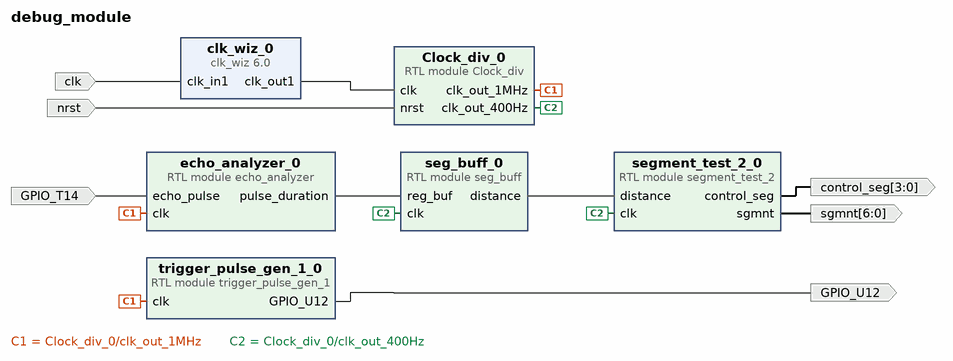
[diagram p0: block diagram of the top level]
# Vivado block design debug_module, xc7z020clg400-1, Vivado 2023.1
create_bd_design debug_module

create_bd_port -dir O GPIO_U12
create_bd_port -dir I GPIO_T14
create_bd_port -dir O -from 6 -to 0 sgmnt
create_bd_port -dir O -from 3 -to 0 control_seg
create_bd_port -dir I clk
create_bd_port -dir I nrst

create_bd_cell -type module -reference Clock_div Clock_div_0
create_bd_cell -type module -reference segment_test_2 segment_test_2_0
create_bd_cell -type module -reference trigger_pulse_gen_1 trigger_pulse_gen_1_0
create_bd_cell -type ip -vlnv xilinx.com:ip:clk_wiz:6.0 clk_wiz_0
set_property -dict [list \
  CONFIG.CLKIN1_JITTER_PS 80.0 \
  CONFIG.CLKOUT1_DRIVES BUFG \
  CONFIG.CLKOUT1_JITTER 288.707 \
  CONFIG.CLKOUT1_PHASE_ERROR 258.220 \
  CONFIG.CLKOUT1_REQUESTED_OUT_FREQ 50 \
  CONFIG.CLKOUT2_DRIVES BUFG \
  CONFIG.CLKOUT3_DRIVES BUFG \
  CONFIG.CLKOUT4_DRIVES BUFG \
  CONFIG.CLKOUT5_DRIVES BUFG \
  CONFIG.CLKOUT6_DRIVES BUFG \
  CONFIG.CLKOUT7_DRIVES BUFG \
  CONFIG.CLK_IN1_BOARD_INTERFACE sys_clock \
  CONFIG.MMCM_BANDWIDTH OPTIMIZED \
  CONFIG.MMCM_CLKFBOUT_MULT_F 34 \
  CONFIG.MMCM_CLKIN1_PERIOD 8.000 \
  CONFIG.MMCM_CLKIN2_PERIOD 10.0 \
  CONFIG.MMCM_CLKOUT0_DIVIDE_F 17 \
  CONFIG.MMCM_COMPENSATION ZHOLD \
  CONFIG.MMCM_DIVCLK_DIVIDE 5 \
  CONFIG.PRIMITIVE PLL \
] [get_bd_cells clk_wiz_0]
create_bd_cell -type module -reference echo_analyzer echo_analyzer_0
create_bd_cell -type module -reference seg_buff seg_buff_0

# ---- connections ----

connect_bd_net [get_bd_pins Clock_div_0/clk_out_1MHz] [get_bd_pins echo_analyzer_0/clk] [get_bd_pins trigger_pulse_gen_1_0/clk]
connect_bd_net [get_bd_pins Clock_div_0/clk_out_400Hz] [get_bd_pins segment_test_2_0/clk] [get_bd_pins seg_buff_0/clk]
connect_bd_net -net GPIO_T14_1 [get_bd_ports GPIO_T14] [get_bd_pins echo_analyzer_0/echo_pulse]
connect_bd_net [get_bd_ports clk] [get_bd_pins clk_wiz_0/clk_in1]
connect_bd_net [get_bd_pins clk_wiz_0/clk_out1] [get_bd_pins Clock_div_0/clk]
connect_bd_net [get_bd_pins echo_analyzer_0/pulse_duration] [get_bd_pins seg_buff_0/reg_buf]
connect_bd_net [get_bd_ports nrst] [get_bd_pins Clock_div_0/nrst]
connect_bd_net [get_bd_pins seg_buff_0/distance] [get_bd_pins segment_test_2_0/distance]
connect_bd_net [get_bd_pins segment_test_2_0/control_seg] [get_bd_ports control_seg]
connect_bd_net [get_bd_pins segment_test_2_0/sgmnt] [get_bd_ports sgmnt]
connect_bd_net [get_bd_pins trigger_pulse_gen_1_0/GPIO_U12] [get_bd_ports GPIO_U12]

validate_bd_design
save_bd_design
